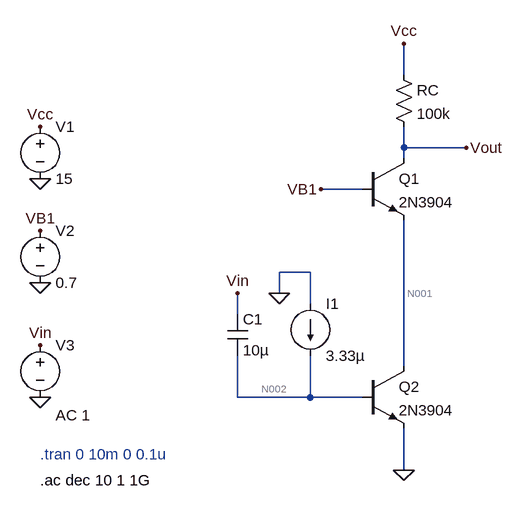
[diagram p0: schematic cascode_amplifier.asc]
cascode_amplifier.asc, the LTspice schematic file:
Version 4.1
SHEET 1 880 680
WIRE 256 -48 256 -96
WIRE 256 64 256 32
WIRE 352 64 256 64
WIRE 256 80 256 64
WIRE 192 128 128 128
WIRE 112 256 64 256
WIRE 64 288 64 256
WIRE 112 304 112 256
WIRE 0 320 0 288
WIRE 256 400 256 176
WIRE 0 448 0 384
WIRE 112 448 112 384
WIRE 112 448 0 448
WIRE 192 448 112 448
WIRE 256 560 256 496
FLAG 256 560 0
FLAG -304 272 0
FLAG -304 112 0
FLAG 64 288 0
FLAG 0 288 Vin
FLAG -304 192 VB1
FLAG 256 -96 Vcc
FLAG -304 32 Vcc
FLAG 352 64 Vout
FLAG -304 448 0
FLAG -304 368 Vin
FLAG 128 128 VB1
SYMBOL npn 192 80 R0
SYMATTR InstName Q1
SYMATTR Value 2N3904
SYMBOL res 240 -64 R0
SYMATTR InstName RC
SYMATTR Value 100k
SYMBOL cap -16 320 R0
SYMATTR InstName C1
SYMATTR Value 10µ
SYMBOL current 112 304 R0
WINDOW 123 0 0 Left 0
WINDOW 39 0 0 Left 0
SYMATTR InstName I1
SYMATTR Value 3.33µ
SYMBOL voltage -304 16 R0
WINDOW 123 0 0 Left 0
WINDOW 39 0 0 Left 0
SYMATTR InstName V1
SYMATTR Value 15
SYMBOL voltage -304 176 R0
WINDOW 123 0 0 Left 0
WINDOW 39 0 0 Left 0
SYMATTR InstName V2
SYMATTR Value 0.7
SYMBOL npn 192 400 R0
SYMATTR InstName Q2
SYMATTR Value 2N3904
SYMBOL voltage -304 352 R0
WINDOW 123 24 124 Left 2
WINDOW 39 0 0 Left 0
SYMATTR InstName V3
SYMATTR Value ""
SYMATTR Value2 AC 1
TEXT -304 536 Left 2 ;.tran 0 10m 0 0.1u
TEXT -304 576 Left 2 !.ac dec 10 1 1G

The netlist it stands for:
* cascode_amplifier.asc
Q1 Vout VB1 N001 0 2N3904
RC Vcc Vout 100k
C1 Vin N002 10µ
I1 0 N002 3.33µ
V1 Vcc 0 15
V2 VB1 0 0.7
Q2 N001 N002 0 0 2N3904
V3 Vin 0 AC 1
.model NPN NPN
.model PNP PNP
.lib standard.bjt
* .tran 0 10m 0 0.1u
.ac dec 10 1 1G
.backanno
.end

* Results of the author's LTspice run, read from the files saved beside the schematic
* Operating Point, zero values left out:
*   V(vb1) = 700 mV
*   V(vcc) = 15 V
*   V(vout) = 98.58 mV
*   V(n001) = 75.09 mV
*   V(n002) = 612.9 mV
*   Ic(Q1) = 149 µA
*   Ib(Q1) = 31.63 µA
*   Ie(Q1) = -180.6 µA
*   I(V1) = -149 µA
*   I(V2) = -31.63 µA
*   I(I1) = 3.33 µA
*   Ic(Q2) = 180.6 µA
*   Ib(Q2) = 3.33 µA
*   Ie(Q2) = -184 µA
*   I(RC) = 149 µA
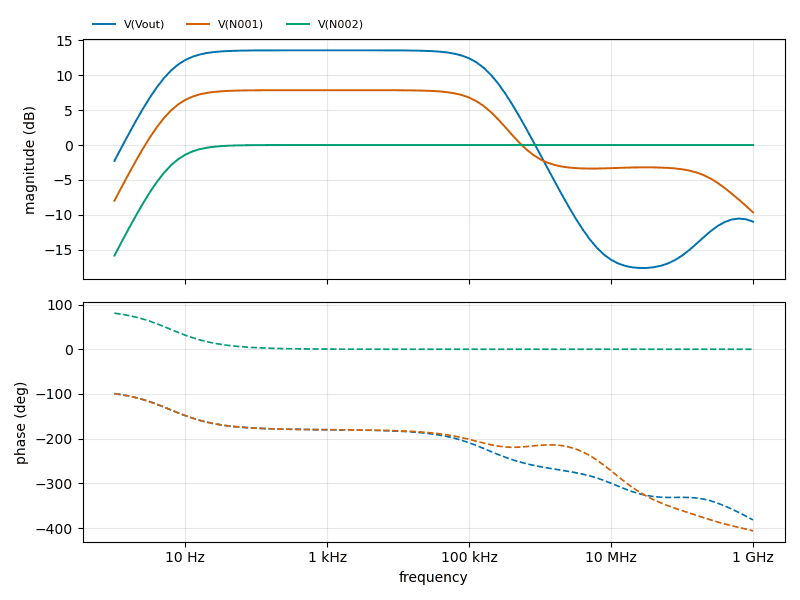
[diagram p1: AC Analysis of cascode_amplifier.asc, plotted from the saved traces]
* AC Analysis, 1 run:
*   V(Vout): -2.27 dB at 1 Hz, -10.97 dB at 1 GHz, peak 13.55 dB at 1 kHz, 3 dB below the peak at 6.121 Hz and 179.9 kHz
*   V(N001): -7.98 dB at 1 Hz, -9.65 dB at 1 GHz, peak 7.85 dB at 1 kHz, 3 dB below the peak at 6.121 Hz and 195.5 kHz
*   V(N002): -15.83 dB at 1 Hz, -0.00 dB at 1 GHz, peak -0.00 dB at 1 GHz, 3 dB below the peak at 6.122 Hz